# Altium schematic sheet [01] - Title.SchDoc: QSFP28 FPGA Mezzanine Card
size A4; DocumentNumber: 1; Revision: v1.0; SheetNumber: 1; SheetTotal: 14; ImagePath: C:\Users\user\Documents\Altium\Projects\QSFP28 FPGA Mezzanine Card
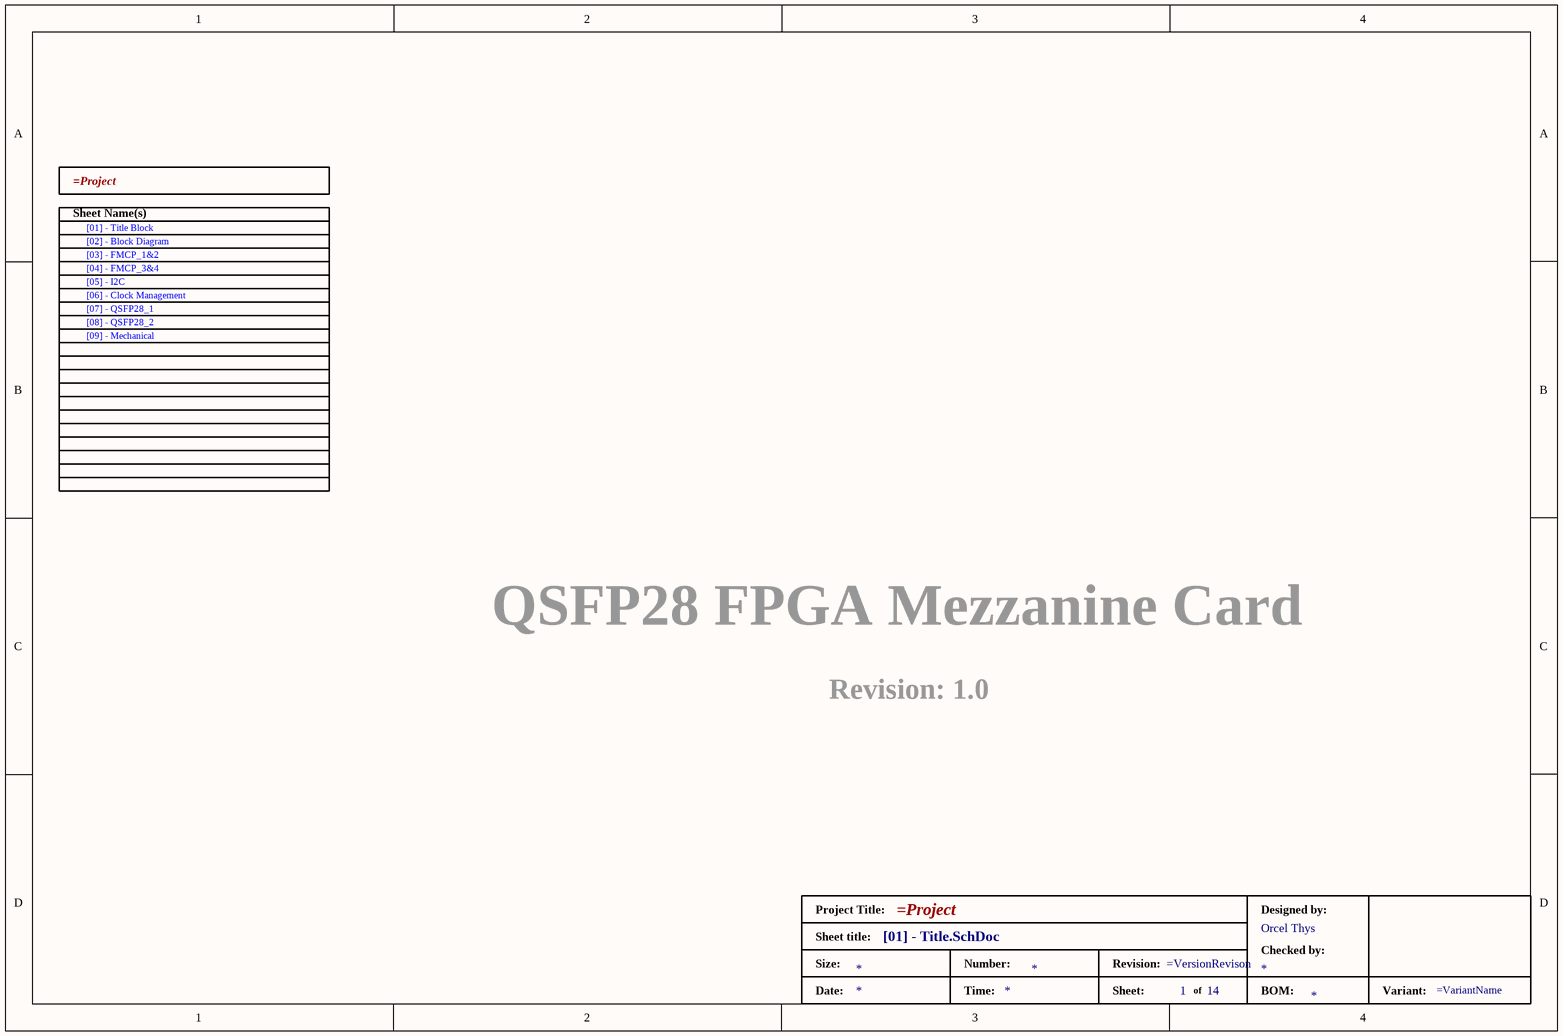
[diagram p0: [01] - Title.SchDoc]

## Parts
(Parts that share a designator on the sheet are numbered #1, #2 ... from top to bottom, then left to right.)
*#1  SheetName17: [09] - Mechanical  SheetName08: [08] - QSFP28_2  SheetName07: [07] - QSFP28_1  SheetName06: [06] - Clock Management  SheetName05: [05] - I2C  SheetName04: [04] - FMCP_3&4  SheetName03: [03] - FMCP_1&2  SheetName02: [02] - Block Diagram  SheetName01: [01] - Title Block  (hidden comment: Table of Contents)  (graphical)
*#2  DesignedBy: Orcel Thys  (hidden comment: Standard Title Block)  (graphical)

## Notes on the sheet
- QSFP28 FPGA Mezzanine Card
- Revision: 1.0
- Title
- Size:
- Date:
- A4
- Number:
- Time:
- Revision:
- Sheet
- of
- File:
- (in symbol Content_Block) Sheet Name(s)
- (in symbol Title_Block) Project Title:; Designed by:; Sheet title:; Checked by:; Size:; Number:; Revision:; Date:; Time:; Sheet:; of; BOM:; Variant:

## Library data of the parts
*#1 = Content_Block: Table of content for the cover page
*#2 = Title_Block: Size: *; BOM: *; DW: *; CheckedBy: *